# Altium schematic sheet [3]_Output_Feedback.SchDoc: Output & Feedback
size A4 portrait; DocumentNumber: 3; SheetNumber: 3; SheetTotal: 8
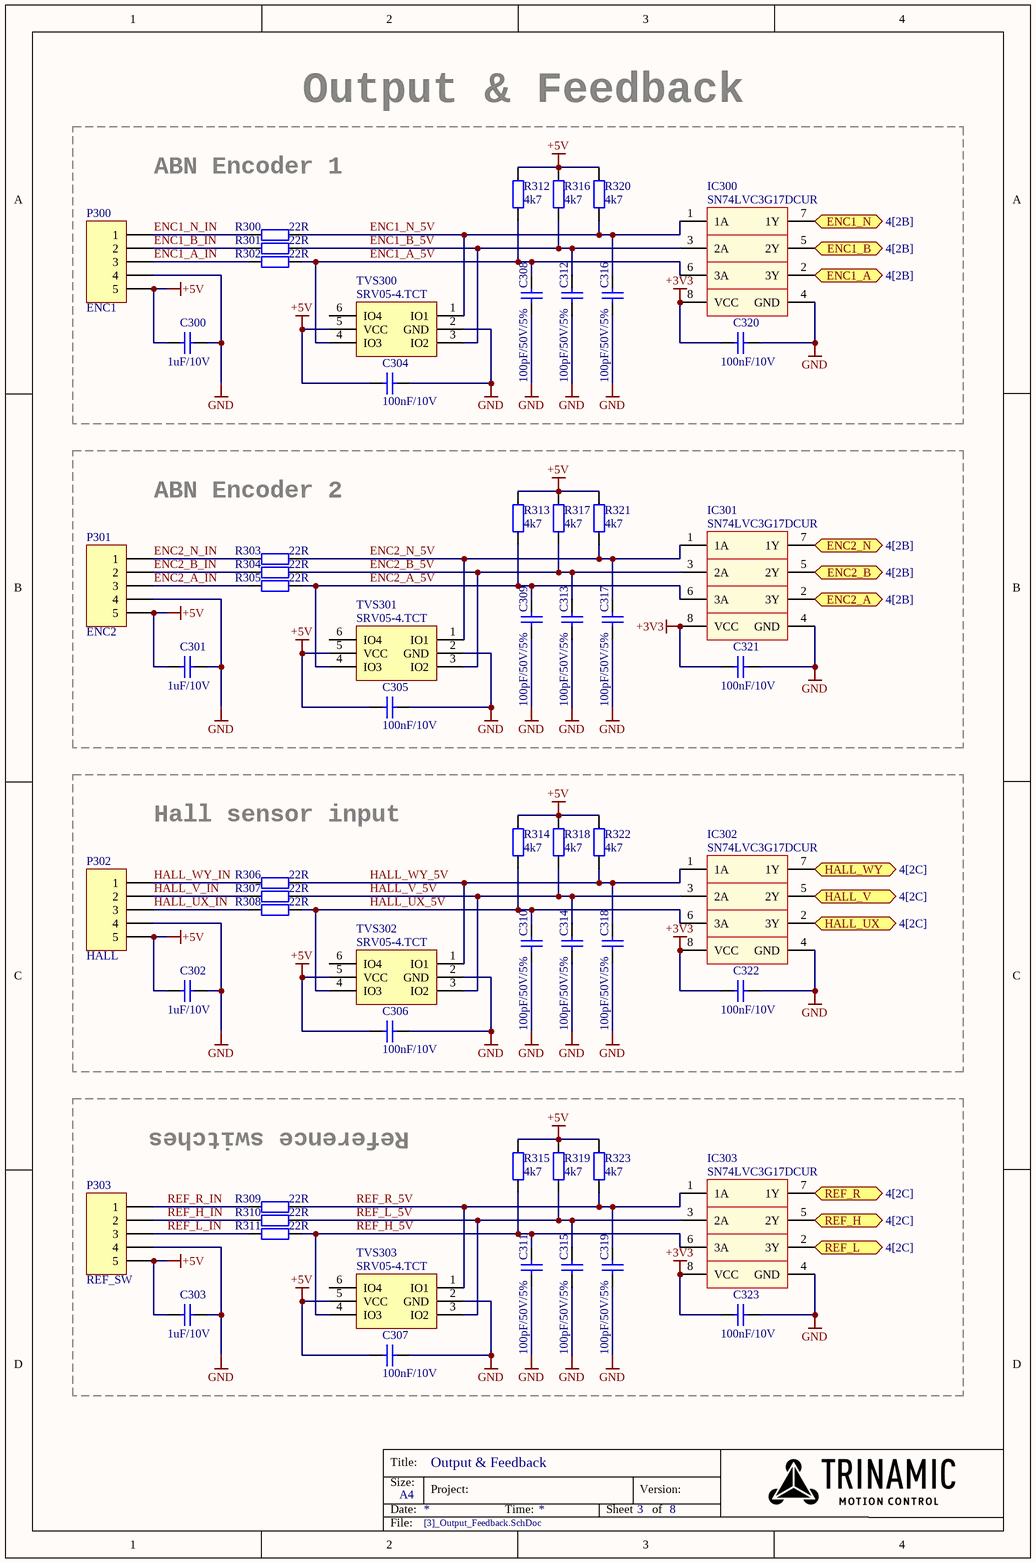
[diagram p0: [3]_Output_Feedback.SchDoc]

## Parts
C300  1uF/10V  [C0603]
C301  1uF/10V  [C0603]
C302  1uF/10V  [C0603]
C303  1uF/10V  [C0603]
C304  100nF/10V  [C0603]
C305  100nF/10V  [C0603]
C306  100nF/10V  [C0603]
C307  100nF/10V  [C0603]
C308  100pF/50V/5%  [C0603]
C309  100pF/50V/5%  [C0603]
C310  100pF/50V/5%  [C0603]
C311  100pF/50V/5%  [C0603]
C312  100pF/50V/5%  [C0603]
C313  100pF/50V/5%  [C0603]
C314  100pF/50V/5%  [C0603]
C315  100pF/50V/5%  [C0603]
C316  100pF/50V/5%  [C0603]
C317  100pF/50V/5%  [C0603]
C318  100pF/50V/5%  [C0603]
C319  100pF/50V/5%  [C0603]
C320  100nF/10V  [C0603]
C321  100nF/10V  [C0603]
C322  100nF/10V  [C0603]
C323  100nF/10V  [C0603]
IC300  SN74LVC3G17DCUR  [TSSOP50P310X90-8L]
IC301  SN74LVC3G17DCUR  [TSSOP50P310X90-8L]
IC302  SN74LVC3G17DCUR  [TSSOP50P310X90-8L]
IC303  SN74LVC3G17DCUR  [TSSOP50P310X90-8L]
P300  ENC1  [TH_HDR_1X5]
P301  ENC2  [TH_HDR_1X5]
P302  HALL  [TH_HDR_1X5]
P303  REF_SW  [TH_HDR_1X5]
R300  22R  [R0603]
R301  22R  [R0603]
R302  22R  [R0603]
R303  22R  [R0603]
R304  22R  [R0603]
R305  22R  [R0603]
R306  22R  [R0603]
R307  22R  [R0603]
R308  22R  [R0603]
R309  22R  [R0603]
R310  22R  [R0603]
R311  22R  [R0603]
R312  4k7  [R0603]
R313  4k7  [R0603]
R314  4k7  [R0603]
R315  4k7  [R0603]
R316  4k7  [R0603]
R317  4k7  [R0603]
R318  4k7  [R0603]
R319  4k7  [R0603]
R320  4k7  [R0603]
R321  4k7  [R0603]
R322  4k7  [R0603]
R323  4k7  [R0603]
TVS300  SRV05-4.TCT  [SOT95P280X145-6N]
TVS301  SRV05-4.TCT  [SOT95P280X145-6N]
TVS302  SRV05-4.TCT  [SOT95P280X145-6N]
TVS303  SRV05-4.TCT  [SOT95P280X145-6N]

## Blocks framed on the sheet
ABN Encoder 1: C300 C304 C308 C312 C316 C320 IC300 P300 R300-R302 R312 R316 R320 TVS300
ABN Encoder 2: C301 C305 C309 C313 C317 C321 IC301 P301 R303-R305 R313 R317 R321 TVS301
Hall sensor input: C302 C306 C310 C314 C318 C322 IC302 P302 R306-R308 R314 R318 R322 TVS302
Reference switches: C303 C307 C311 C315 C319 C323 IC303 P303 R309-R311 R315 R319 R323 TVS303

## Ports
ENC1_A (see 4[2B]), ENC1_B (see 4[2B]), ENC1_N (see 4[2B]), ENC2_A (see 4[2B]), ENC2_B (see 4[2B]), ENC2_N (see 4[2B]), HALL_UX (see 4[2C]), HALL_V (see 4[2C]), HALL_WY (see 4[2C]), REF_H (see 4[2C]), REF_L (see 4[2C]), REF_R (see 4[2C])

## Nets
+3V3: C320.2 C321.2 C322.2 C323.2 IC300.8(VCC) IC301.8(VCC) IC302.8(VCC) IC303.8(VCC)
+5V: C300.2 C301.2 C302.2 C303.2 C304.1 C305.1 C306.1 C307.1 P300.5 P301.5 P302.5 P303.5 R312.2 R313.2 R314.2 R315.2 R316.2 R317.2 R318.2 R319.2 R320.2 R321.2 R322.2 R323.2 TVS300.5(VCC) TVS301.5(VCC) TVS302.5(VCC) TVS303.5(VCC)
GND: C300.1 C301.1 C302.1 C303.1 C304.2 C305.2 C306.2 C307.2 C308.1 C309.1 C310.1 C311.1 C312.1 C313.1 C314.1 C315.1 C316.1 C317.1 C318.1 C319.1 C320.1 C321.1 C322.1 C323.1 IC300.4(GND) IC301.4(GND) IC302.4(GND) IC303.4(GND) P300.4 P301.4 P302.4 P303.4 TVS300.2(GND) TVS301.2(GND) TVS302.2(GND) TVS303.2(GND)
ENC1_A: IC300.2(3Y) ; port ENC1_A
ENC1_A_5V: C308.2 IC300.6(3A) R302.1 R312.1 TVS300.4(IO3)
ENC1_A_IN: P300.3 R302.2
ENC1_B: IC300.5(2Y) ; port ENC1_B
ENC1_B_5V: C312.2 IC300.3(2A) R301.1 R316.1 TVS300.3(IO2)
ENC1_B_IN: P300.2 R301.2
ENC1_N: IC300.7(1Y) ; port ENC1_N
ENC1_N_5V: C316.2 IC300.1(1A) R300.1 R320.1 TVS300.1(IO1)
ENC1_N_IN: P300.1 R300.2
ENC2_A: IC301.2(3Y) ; port ENC2_A
ENC2_A_5V: C309.2 IC301.6(3A) R305.1 R313.1 TVS301.4(IO3)
ENC2_A_IN: P301.3 R305.2
ENC2_B: IC301.5(2Y) ; port ENC2_B
ENC2_B_5V: C313.2 IC301.3(2A) R304.1 R317.1 TVS301.3(IO2)
ENC2_B_IN: P301.2 R304.2
ENC2_N: IC301.7(1Y) ; port ENC2_N
ENC2_N_5V: C317.2 IC301.1(1A) R303.1 R321.1 TVS301.1(IO1)
ENC2_N_IN: P301.1 R303.2
HALL_UX: IC302.2(3Y) ; port HALL_UX
HALL_UX_5V: C310.2 IC302.6(3A) R308.1 R314.1 TVS302.4(IO3)
HALL_UX_IN: P302.3 R308.2
HALL_V: IC302.5(2Y) ; port HALL_V
HALL_V_5V: C314.2 IC302.3(2A) R307.1 R318.1 TVS302.3(IO2)
HALL_V_IN: P302.2 R307.2
HALL_WY: IC302.7(1Y) ; port HALL_WY
HALL_WY_5V: C318.2 IC302.1(1A) R306.1 R322.1 TVS302.1(IO1)
HALL_WY_IN: P302.1 R306.2
REF_H: IC303.5(2Y) ; port REF_H
REF_H_5V: C311.2 IC303.6(3A) R311.1 R315.1 TVS303.4(IO3)
REF_H_IN: P303.2 R310.2
REF_L: IC303.2(3Y) ; port REF_L
REF_L_5V: C315.2 IC303.3(2A) R310.1 R319.1 TVS303.3(IO2)
REF_L_IN: P303.3 R311.2
REF_R: IC303.7(1Y) ; port REF_R
REF_R_5V: C319.2 IC303.1(1A) R309.1 R323.1 TVS303.1(IO1)
REF_R_IN: P303.1 R309.2

Not connected (* = marked no-connect by the designer): TVS300 6(IO4); TVS301 6(IO4); TVS302 6(IO4); TVS303 6(IO4)

## Notes on the sheet
- Title:
- Size:
- Date:
- A4
- Project:
- Time:
- Sheet
- Version:
- of
- File:

## Library data of the parts
C300-C303 = C, 1 µF, 10 V, ± 10%, X5R, MC Series, 0603 [1608 Metric]: SMD Multilayer Ceramic Capacitor, 0603 [1608 Metric], 1 µF, 10 V, ± 10%, X5R, MC Series; MPN: MC0603X105K100CT; Type: MLCC; VoltageRating: 10V; MF: MULTICOMP; Capacitance: 1uF; Characteristic: X5R; Precision: 10%
C304-C307 C320-C323 = C, 0.1 µF, 10 V, ± 10%, X7R, 0603: SMD Multilayer Ceramic Capacitor, 0603 [1608 Metric], 0.1 µF, 10 V, ± 10%, X7R, MC Series; MPN: MC0603B104K100CT; Type: MLCC; VoltageRating: 10V; MF: Multicomp; Capacitance: 100nF; Characteristic: X7R; ComponentLinknURL: *; Precision: 10%
C308-C319 = C, 100 pF, 50 V, ± 5%, C0G / NP0, MC Series, 0603 [1608 Metric]: SMD Multilayer Ceramic Capacitor, 0603 [1608 Metric], 100 pF, 50 V, ± 5%, C0G / NP0, MC Series; MPN: MC0603N101J500CT; Type: MLCC; VoltageRating: 50V; MF: MULTICOMP; Capacitance: 100pF; Characteristic: C0G / NP0; Precision: 5%
IC300-IC303 = SN74LVC3G17DCUR: Triple Schmitt-Trigger Buffer, 74LVC3G17, 1.65 V to 5.5 V, VSSOP-8; MF: TEXAS INSTRUMENTS; MPN: SN74LVC3G17DCUR
P300-P303 = Header 5: Header, 5-Pin
R300-R311 = R, 22 ohm, 50 V, 0603 [1608 Metric], 100 mW, ± 1%, MCWR Series: SMD Chip Resistor, Thick Film, 22 ohm, 50 V, 0603 [1608 Metric], 100 mW, ± 1%, MCWR Series; MPN: MCWR06X22R0FTL; VoltageRating: 50V; Temp coefficient: *ppm; PowerRating: 100mW; MF: MULTICOMP; Precision: 1%; Resistance: 22R
R312-R323 = R, 4.7 kohm, 75 V, 0603 [1608 Metric], 100 mW, ± 1%, WR06 Series: SMD Chip Resistor, 4.7 kohm, 75 V, 0603 [1608 Metric], 100 mW, ± 1%, WR06 Series; MPN: WR06X4701FTL; VoltageRating: 75V; Temp coefficient: *ppm; PowerRating: 100mW; MF: WALSIN; Precision: 1%; Resistance: 4k7
TVS300-TVS303 = ESD, TVS, SRV05-4.TCT: ESD Protection Device, TVS, 17.5 V, SOT-23, 6 Pins, 5 V, 300 W; MF: SEMTECH; MPN: SRV05-4.TCT